# EAGLE design sunrise (EAGLE 9.1.0)
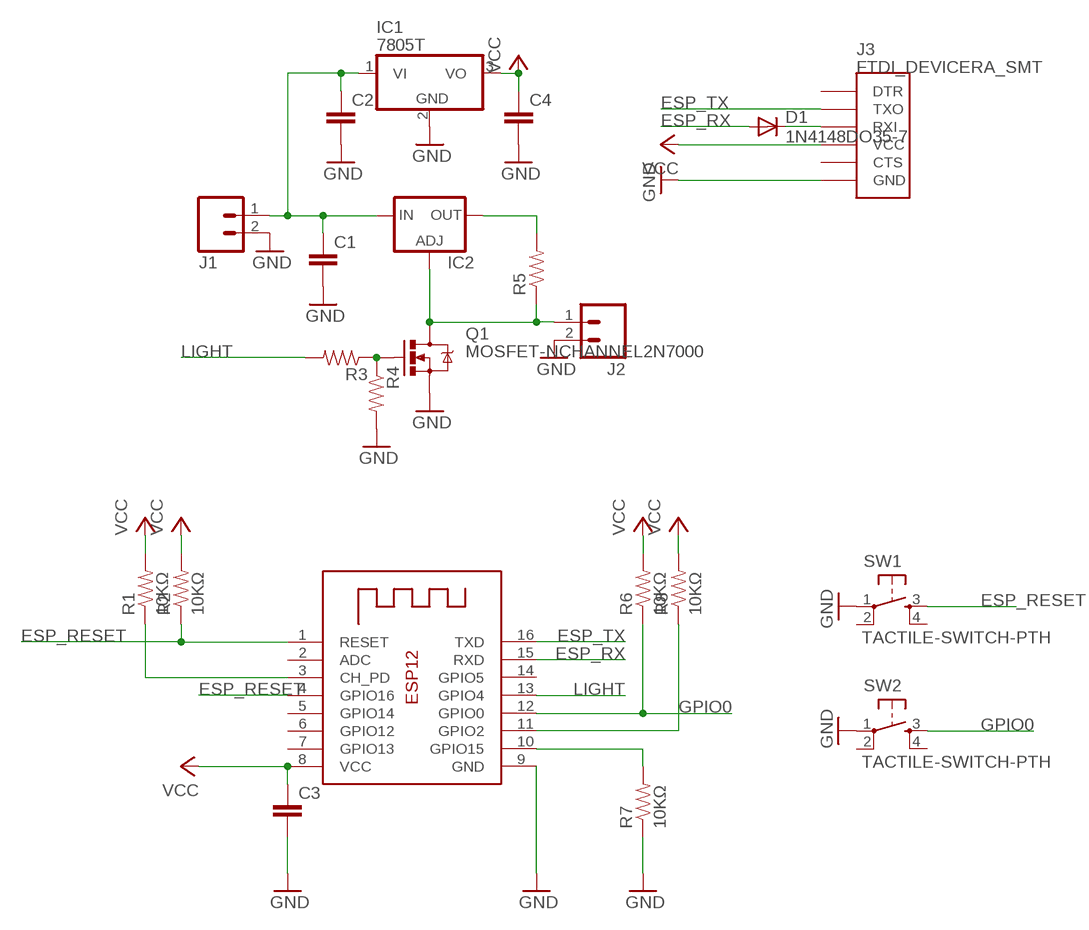
[diagram p0: schematic, sheet 1]

## Parts
C1  0.1UF-50V-20%(PTH)KIT-EZ  [CAP-PTH-SMALL-KIT]
C2  0.1UF-50V-20%(PTH)KIT-EZ  [CAP-PTH-SMALL-KIT]
C3  0.1UF-50V-20%(PTH)KIT-EZ  [CAP-PTH-SMALL-KIT]
C4  0.1UF-50V-20%(PTH)KIT-EZ  [CAP-PTH-SMALL-KIT]
D1  1N4148DO35-7  [DO35-7]
IC1  7805T  [TO220H]
IC2  LM317-TO3  [TO3-K02]
J1  M02LOCK_LONGPADS  [1X02_LOCK_LONGPADS]
J2  M02LOCK_LONGPADS  [1X02_LOCK_LONGPADS]
J3  FTDI_DEVICERA_SMT  [FTDI_DEVICE_RA_SMT]
Q1  MOSFET-NCHANNEL2N7000  [TO-92]
R1  10KΩ  RESISTORPTH-1/4W  [AXIAL-0.4]
R2  10KΩ  RESISTORPTH-1/4W  [AXIAL-0.4]
R3  RESISTORPTH-1/4W  [AXIAL-0.4]
R4  RESISTORPTH-1/4W  [AXIAL-0.4]
R5  RESISTORPTH-1W  [AXIAL-0.6]
R6  10KΩ  RESISTORPTH-1/4W  [AXIAL-0.4]
R7  10KΩ  RESISTORPTH-1/4W  [AXIAL-0.4]
R8  10KΩ  RESISTORPTH-1/4W  [AXIAL-0.4]
SW1  TACTILE-SWITCH-PTH  [TAC-SWITCH-PTH]
SW2  TACTILE-SWITCH-PTH  [TAC-SWITCH-PTH]
X1  ESP-12e  ESP-12  [ESP-12]

## Nets
!CS: R7.P$2 X1.10(GPIO15)
!D/C: R8.P$1 X1.11(GPIO2)
ESP_RESET: R2.P$1 SW1.3 X1.1(RESET) X1.4(GPIO16)
ESP_RX: D1.A X1.15(RXD)
ESP_TX: J3.2(TXO) X1.16(TXD)
GND: C1.2 C2.2 C3.2 C4.2 IC1.2(GND) J1.2 J2.2 J3.6(GND) Q1.1(S) R4.P$2 R7.P$1 SW1.1 SW2.1 X1.9(GND)
GPIO0: R6.P$1 SW2.3 X1.12(GPIO0)
LIGHT: R3.P$2 X1.13(GPIO4)
N$1: C1.1 C2.1 IC1.1(VI) IC2.1(IN) J1.1
N$2: IC2.3(OUT) R5.P$2
N$3: IC2.2(ADJ) J2.1 Q1.3(D) R5.P$1
N$4: Q1.2(G) R3.P$1 R4.P$1
N$7: D1.C J3.3(RXI)
N$57: R1.P$1 X1.3(CH_PD)
VCC [power]: C3.1 C4.1 IC1.3(VO) J3.4(VCC) R1.P$2 R2.P$2 R6.P$2 R8.P$2 X1.8(VCC)
Unconnected: J3.1(DTR) J3.5(CTS) SW1.2 SW1.4 SW2.2 SW2.4 X1.2(ADC) X1.5(GPIO14) X1.6(GPIO12) X1.7(GPIO13) X1.14(GPIO5)

## Library data of the parts
C1-C4 = SparkFun-Capacitors:0.1UF-50V-20%(PTH): CAP-08370; PROD_ID: CAP-08370
D1 = diode:1N4148: DIODE high speed (Philips)
IC1 = linear:78*: Positive VOLTAGE REGULATOR Source: http://cache.national.com/ds/LM/LM78L05.pdf http://www.fairchildsemi.com/ds/LM/LM7805.pdf
IC2 = v-reg:LM317-TO3: VOLTAGE REGULATOR
J1 J2 = SparkFun-Connectors:M02: Standard 2-pin 0.1" header. Use with - straight break away headers ( PRT-00116) - right angle break away headers (PRT-00553) - swiss pins (PRT-00743) - machine pins (PRT-00117) - female headers (PRT-00115) Molex polarized connector foot print use with: PRT-08233 with associated crimp pins and housings. 2.54_SCREWTERM for use with PRT-10571. 3.5mm Screw Terminal footprints for PRT-08084 5mm Screw Terminal footprints for use with PRT-08432
J3 = SparkFun-Connectors:FTDI_DEVICE: Connector which mates to FTDI basic or FTDI cable.; PROD_ID: CONN-08971
Q1 = SparkFun-DiscreteSemi:MOSFET-NCHANNEL: Common NMOSFET Parts MFG P/N Store ID Prod ID FDD8780 TRANS-09984 SI7820DN TRANS-11055 FDS6630A IC-08089 2N7002PW TRANS-11151 FQP30N06L COM-10213 TRANS-10060 BSS123LT1G TRANS-08345 BSS138 TRANS-00830 BS170 2N7000
R1-R8 = SparkFun-Resistors:RESISTOR: Resistor Basic schematic elements and footprints for 0603, 1206, and PTH resistors.
SW1 SW2 = GeekAmmo:TACTILE-SWITCH: Tactile Switch 4 Pins, SPST NO
X1 = adafruit:ESP-12

## Net classes
2 power: width 0.203 mm

## Board
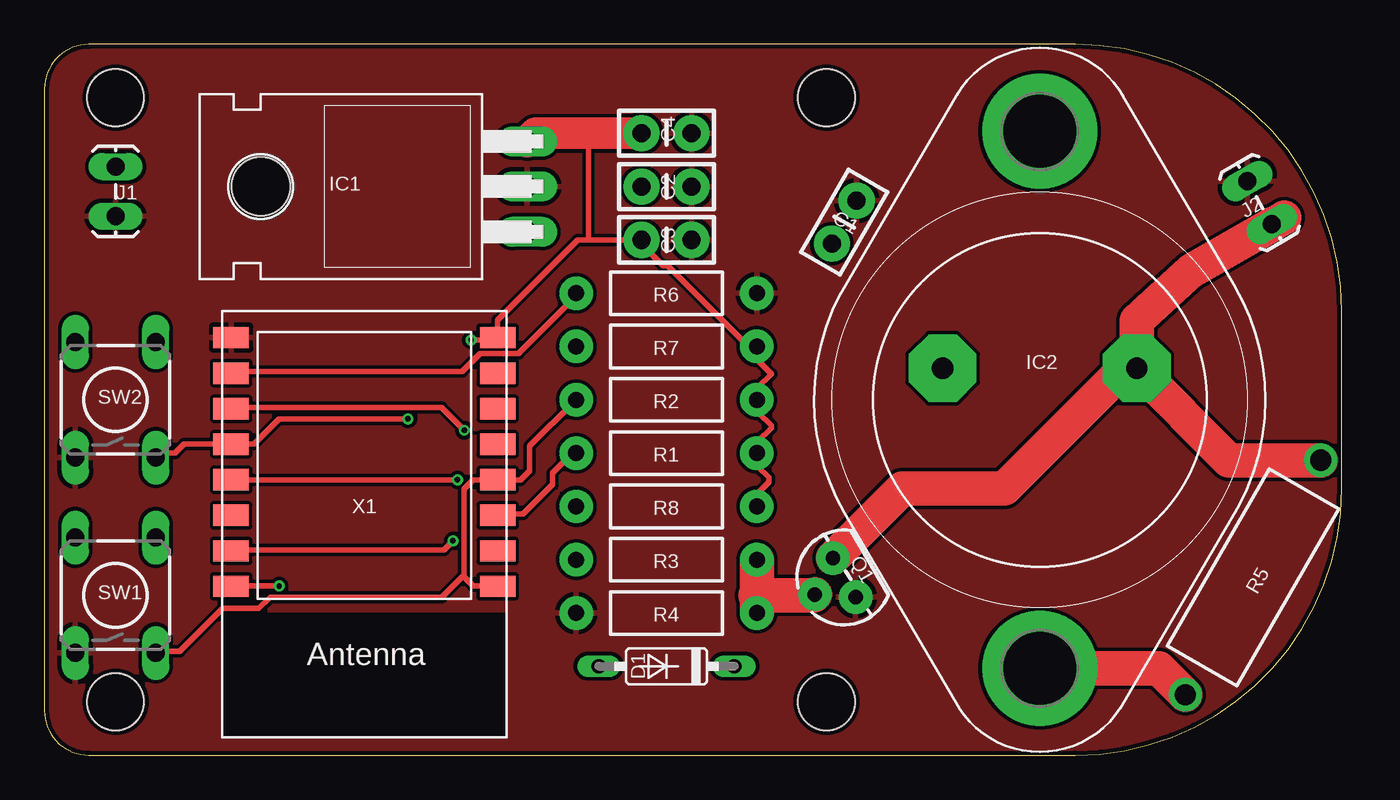
[diagram p1: board, top side]
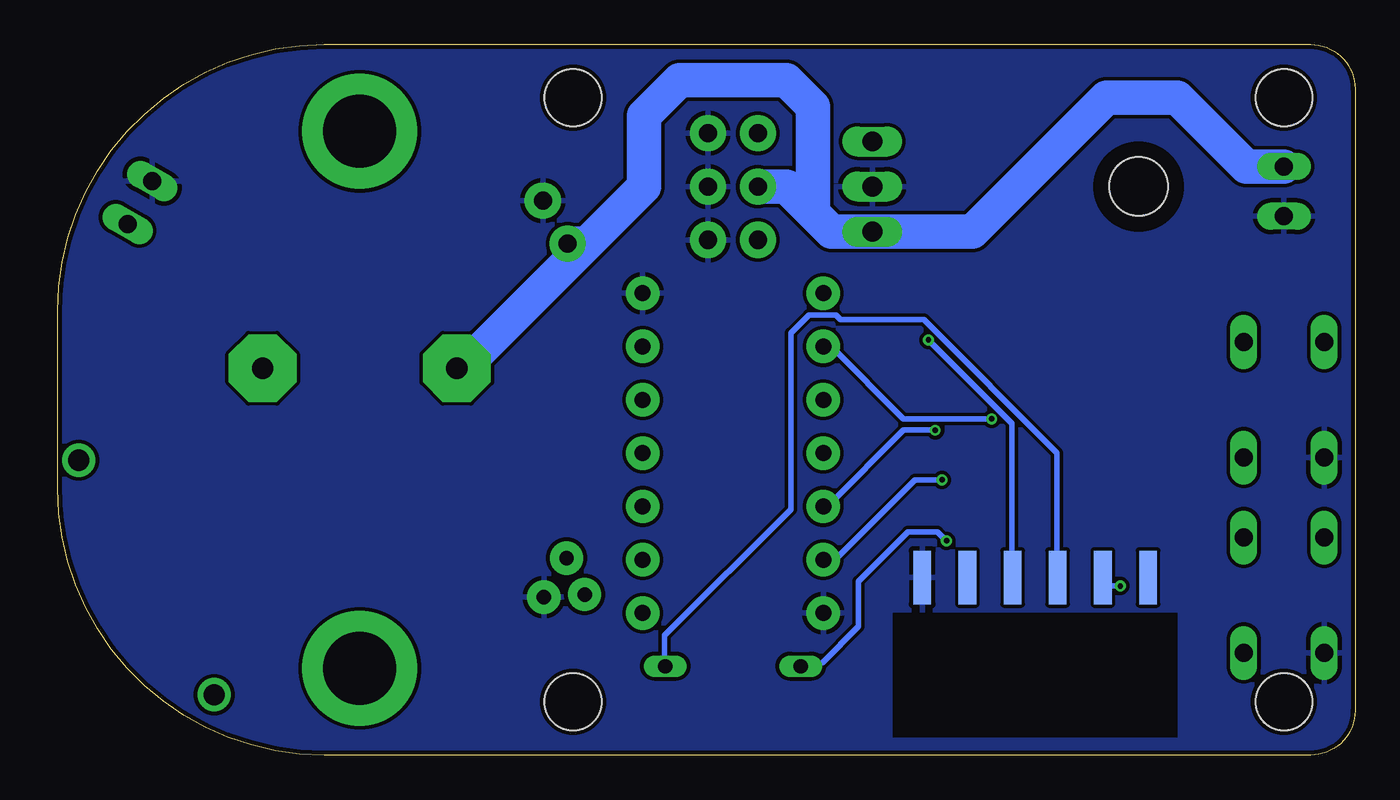
[diagram p2: board, bottom side, seen from below]

Size 73 x 40 mm. Coordinates in mm from the lower left corner, seen from the top.
Outline: 0,37.5 0,2.5 arc90 2.5,0 58,0 arc90 73,15 73,25 arc90 58,40 2.5,40 arc90 0,37.5
Copper layers (1*16): Top 0.035mm / dielectric 1.5mm / Bottom 0.035mm
Design rules "MF_Standard_2_Layer *": minimum track width 12mil, minimum drill 12mil, track to track 8mil, track to pad 5mil, pad to pad 5mil, via to via 5mil, smd to smd 0mil, copper to edge 10mil, drill to drill 10mil, minimum pad ring 6mil, minimum via ring 6mil, stop-mask expansion 2mil, vias tented up to drill 25mil, thermal gap 10mil
Holes 3.2 mm at 4,37 4,3 44,3 44,37

### Footprints (pad centres in the part's own frame; a part is rotated, then mirrored left to right if it is on the bottom)
CAP-PTH-SMALL-KIT = drill 1.016 pad 2.032: 1 -1.397,0; 2 1.397,0
DO35-7 = drill 0.813 long: A 3.81,0; C -3.81,0
TO220H = drill 1.118 long: 1 -2.54,-10.16; 2 0,-10.16; 3 2.54,-10.16 | hole 3.302: 0,4.826
TO3-K02 = drill 1.194 pad 3.81 octagon: 1 -1.778,-5.461; 2 -1.778,5.461 | drill 4.115 pad 6.477: 3 15.113,0; 3@ -15.113,0
1X02_LOCK_LONGPADS = drill 1.016 long: 1 -0.127,0; 2 2.667,0
FTDI_DEVICE_RA_SMT = smd 1 x 3: 1 -6.35,5; 2 -3.81,5; 3 -1.27,5; 4 1.27,5; 5 3.81,5; 6 6.35,5
TO-92 = drill 0.813 pad 1.88: 1 -1.27,0; 2 0,1.905; 3 1.27,0
AXIAL-0.4 = drill 0.9 pad 1.88: P$1 -5.08,0; P$2 5.08,0
AXIAL-0.6 = drill 1.2 pad 1.88: P$1 -7.62,0; P$2 7.62,0
TAC-SWITCH-PTH = drill 1.016 pad 1.524 long: 1 -3.251,2.261; 2 3.251,2.261; 3 -3.251,-2.261; 4 3.251,-2.261
ESP-12 = smd 2 x 1.2: 1 -7.5,4.5; 2 -7.5,2.5; 3 -7.5,0.5; 4 -7.5,-1.5; 5 -7.5,-3.5; 6 -7.5,-5.5; 7 -7.5,-7.5; 8 -7.5,-9.5; 9 7.5,-9.5; 10 7.5,-7.5; 11 7.5,-5.5; 12 7.5,-3.5; 13 7.5,-1.5; 14 7.5,0.5; 15 7.5,2.5; 16 7.5,4.5

### Placement (x,y rotation side)
C1  45,30 60 top
C2  35,32 0 top
C3  35,29 0 top
C4  35,35 0 top
D1  35,5 180 top
IC1  17,32 90 top
IC2  56,20 270 top
J1  4,33 270 top
J2  69,30 120 top
J3  18,15 180 bottom
Q1  45,10 120 top
R1  35,17 0 top
R2  35,20 0 top
R3  35,11 180 top
R4  35,8 180 top
R5  68,10 240 top
R6  35,23 0 top
R7  35,26 180 top
R8  35,14 0 top
SW1  4,9 90 top
SW2  4,20 90 top
X1  18,14 180 top

### Tracks (layer width: path | path; a pad name or v marks a point on that pad's centre or on a via)
!CS
  Top 0.305: X1.10 10.54,21.59 23.5,21.59 24.51,22.61 26.67,22.61 29.97,25.91 R7.P$2
!D/C  (via drill 0.3)
  Top 0.305: v23.62,18.29 22.35,19.56 10.54,19.56 X1.11
  Bottom 0.305: v23.62,18.29 25.4,18.29 29.59,14.1 29.84,14.1 R8.P$1
ESP_RESET
  Top 0.305: 23.62,10.03 24.13,9.53 25.4,9.53 X1.1 | 23.62,10.03 23.62,14.99 24.13,15.49 25.4,15.49 X1.4 25.53,15.49 26.8,15.49 27.3,16 27.3,17.4 29.84,19.94 R2.P$1 | SW1.3 6.35,5.84 7.62,5.84 10.03,8.26 12.06,8.26 12.7,8.89 22.35,8.89 23.5,10.03 23.62,10.03
ESP_RX  (via drill 0.3)
  Top 0.305: v22.99,12.06 22.48,11.56 10.54,11.56 X1.15
  Bottom 0.305: v22.99,12.06 23.5,12.57 25.15,12.57 27.94,9.78 27.94,7.24 29.97,5.21 30.1,5.21 30.23,5.08 31.11,5.08 D1.A
ESP_TX  (via drill 0.3)
  Top 0.305: v13.21,9.53 10.54,9.53 X1.16
  Bottom 0.305: v13.21,9.53 13.84,9.53 14.22,9.91 J3.2
GND
  pour Top: 0,40 74,40 74,0 0,0
  pour Bottom: 0,40 74,40 74,0 0,0
GPIO0  (via drill 0.3)
  Top 0.305: SW2.3 6.35,16.76 6.6,17.02 7.37,17.02 7.87,17.53 10.41,17.53 X1.12 10.54,17.53 11.81,17.53 13.21,18.92 v20.45,18.92
  Bottom 0.305: v20.45,18.92 25.4,18.92 29.46,22.99 29.84,22.99 R6.P$1
LIGHT  (via drill 0.3)
  Top 0.305: v23.24,15.49 10.54,15.49 X1.13
  Bottom 0.305: v23.24,15.49 24.77,15.49 29.21,11.05 29.84,11.05 R3.P$2
N$1
  Bottom 1.93: 30.5,30.5 29.46,29.46 IC1.1 21.54,29.46 14,37 10,37 6.13,33.13 J1.1 | 30.5,30.5 32,32 C2.1 | C1.1 43.21,28.79 | 43.21,28.79 40,32 40,36 38,38 32,38 30.5,36.5 30.5,30.5 | IC2.1 50.22,21.78 43.21,28.79
N$2
  Top 1.93: IC2.3 62.7,4.89 R5.P$2
N$3
  Top 1.93: IC2.2 61.46,24.46 64.5,27.25 69.08,29.86 | 69.08,29.86 69.75,30.25 | R5.P$1 66.64,16.6 IC2.2 | J2.1 69.08,29.86 | Q1.3 48.27,15 54,15 60.78,21.78 IC2.2
N$4
  Top 1.93: Q1.2 43.3,9 40,9 40.08,9.08 | 40.08,9.08 R3.P$1 | R4.P$1 40.08,9.08
N$7
  Bottom 0.305: D1.C 38.86,5.08 38.86,6.73 31.75,13.84 31.75,23.75 30.73,24.77 29.21,24.77 28.96,24.51 24.26,24.51 16.76,17.02 16.76,10.03 J3.3
N$57
  Top 0.305: X1.3 25.53,13.59 26.92,13.59 28.57,15.24 28.57,15.88 29.59,16.89 29.84,16.89 R1.P$1
VCC  (via drill 0.3)
  Top 0.305: 30.61,29 C3.1 33.4,28.96 34.8,27.56 35.05,27.56 39.5,23.11 40.01,23.11 R6.P$2 40.13,22.99 40.13,22.23 40.89,21.46 40.13,20.7 40.13,20.07 R2.P$2 40.13,19.94 40.13,19.3 40.89,18.54 40.89,18.41 40.13,17.65 40.13,17.02 R1.P$2 40.13,16.89 40.13,16.26 40.77,15.62 40.77,15.37 40.13,14.73 40.13,14.1 R8.P$2 | 30.61,29 30,29 25.5,24.5 X1.8 25.53,23.37 v24,23.37 | 30.61,29 30.61,35
  Top 1.778: IC1.3 27.62,35 30.61,35 C4.1
  Bottom 0.305: v24,23.37 19.3,18.67 19.3,10.03 J3.4